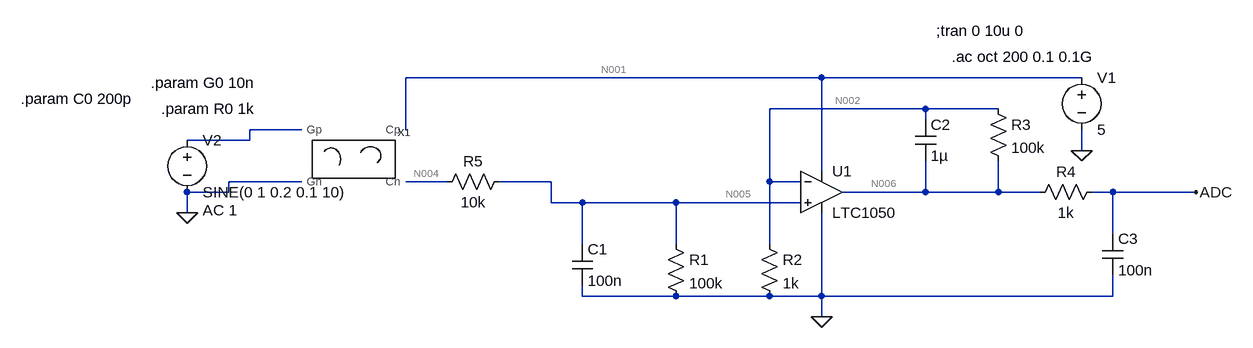
[diagram p0: schematic capteur.asc]
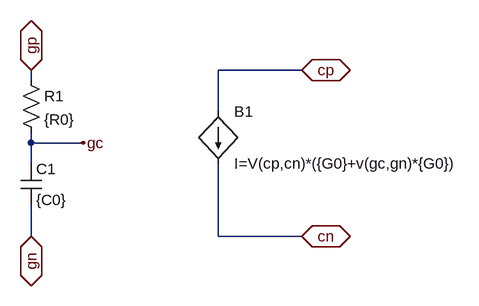
[diagram p1: sub-circuit gp_capteur_graphite.asc]
capteur.asc, the LTspice schematic file:
Version 4
SHEET 1 976 680
WIRE 336 -80 -304 -80
WIRE 736 -80 336 -80
WIRE 496 -32 256 -32
WIRE 608 -32 496 -32
WIRE 496 -16 496 -32
WIRE -464 0 -544 0
WIRE -304 0 -304 -80
WIRE -544 16 -544 0
WIRE -544 16 -640 16
WIRE 736 32 736 0
WIRE 336 64 336 -80
WIRE -464 80 -576 80
WIRE -240 80 -304 80
WIRE -80 80 -160 80
WIRE 256 80 256 -32
WIRE 304 80 256 80
WIRE -576 96 -576 80
WIRE -576 96 -640 96
WIRE 496 96 496 48
WIRE 496 96 368 96
WIRE 608 96 608 48
WIRE 608 96 496 96
WIRE 672 96 608 96
WIRE 784 96 752 96
WIRE 912 96 784 96
WIRE -80 112 -80 80
WIRE -32 112 -80 112
WIRE 112 112 -32 112
WIRE 304 112 112 112
WIRE -640 128 -640 96
WIRE 784 160 784 96
WIRE -32 176 -32 112
WIRE 112 176 112 112
WIRE 256 176 256 80
WIRE -32 256 -32 240
WIRE 112 256 -32 256
WIRE 256 256 112 256
WIRE 336 256 336 128
WIRE 336 256 256 256
WIRE 784 256 784 224
WIRE 784 256 336 256
WIRE 336 288 336 256
FLAG 336 288 0
FLAG 912 96 ADC
FLAG 736 32 0
FLAG -640 128 0
SYMBOL cap -48 176 R0
SYMATTR InstName C1
SYMATTR Value 100n
SYMBOL res 240 160 R0
SYMATTR InstName R2
SYMATTR Value 1k
SYMBOL OpAmps\\LTC1050 336 32 R0
SYMATTR InstName U1
SYMBOL res 96 160 R0
SYMATTR InstName R1
SYMATTR Value 100k
SYMBOL cap 480 -16 R0
SYMATTR InstName C2
SYMATTR Value 1µ
SYMBOL res 592 -48 R0
SYMATTR InstName R3
SYMATTR Value 100k
SYMBOL res 768 80 R90
WINDOW 0 0 56 VBottom 2
WINDOW 3 32 56 VTop 2
SYMATTR InstName R4
SYMATTR Value 1k
SYMBOL cap 768 160 R0
SYMATTR InstName C3
SYMATTR Value 100n
SYMBOL voltage 736 -96 R0
WINDOW 123 24 44 Left 2
WINDOW 39 0 0 Left 0
SYMATTR InstName V1
SYMATTR Value 5
SYMBOL res -144 64 R90
WINDOW 0 0 56 VBottom 2
WINDOW 3 32 56 VTop 2
SYMATTR InstName R5
SYMATTR Value 10k
SYMBOL GP_Capteur_Graphite -400 16 R0
SYMATTR InstName X1
SYMBOL voltage -640 0 R0
WINDOW 123 24 124 Left 2
WINDOW 39 0 0 Left 0
SYMATTR InstName V2
SYMATTR Value SINE(0 1 0.2 0.1 10)
SYMATTR Value2 AC 1
TEXT 512 -152 Left 2 !;tran 0 10u 0
TEXT 536 -112 Left 2 !.ac oct 200 0.1 0.1G
TEXT -696 -72 Left 2 !.param G0 10n
TEXT -680 -32 Left 2 !.param R0 1k
TEXT -896 -48 Left 2 !.param C0 200p

gp_capteur_graphite.asc, the sub-circuit schematic file:
Version 4
SHEET 1 880 680
WIRE 480 16 352 16
WIRE 64 32 64 16
WIRE 352 80 352 16
WIRE 64 128 64 112
WIRE 144 128 64 128
WIRE 64 160 64 128
WIRE 64 272 64 224
WIRE 352 272 352 160
WIRE 480 272 352 272
FLAG 64 16 gp
IOPIN 64 16 BiDir
FLAG 64 272 gn
IOPIN 64 272 BiDir
FLAG 144 128 gc
FLAG 480 16 cp
IOPIN 480 16 BiDir
FLAG 480 272 cn
IOPIN 480 272 BiDir
SYMBOL res 48 16 R0
SYMATTR InstName R1
SYMATTR Value {R0}
SYMBOL cap 48 160 R0
SYMATTR InstName C1
SYMATTR Value {C0}
SYMBOL bi 352 80 R0
SYMATTR InstName B1
SYMATTR Value I=V(cp,cn)*({G0}+v(gc,gn)*{G0})

The netlist it stands for:
* capteur.asc
C1 N005 0 100n
R2 N002 0 1k
XU1 N005 N002 N001 0 N006 LTC1050  ; pins In+ In- V+ V- OUT
R1 N005 0 100k
C2 N002 N006 1µ
R3 N002 N006 100k
R4 ADC N006 1k
C3 ADC 0 100n
V1 N001 0 5
R5 N005 N004 10k
XX1 N001 N004 N003 0 gp_capteur_graphite
V2 N003 0 SINE(0 1 0.2 0.1 10) AC 1

* block symbol definitions
.subckt gp_capteur_graphite Cp Cn Gp Gn
R1 gp gc {R0}
C1 gc gn {C0}
B1 cp cn I=V(cp,cn)*({G0}+v(gc,gn)*{G0})
.ends gp_capteur_graphite

;tran 0 10u 0
.ac oct 200 0.1 0.1G
.param G0 10n
.param R0 1k
.param C0 200p
.lib LTC.lib
.backanno
.end

* Results of the author's LTspice run, read from the files saved beside the schematic
* Operating Point, zero values left out:
*   V(n005) = 4.995 mV
*   V(n002) = 4.995 mV
*   V(n001) = 5 V
*   V(n006) = 504.4 mV
*   V(adc) = 504.4 mV
*   V(n004) = 5.494 mV
*   I(R2) = 4.995 µA
*   I(R1) = 49.95 nA
*   I(R3) = -4.995 µA
*   I(R5) = -49.95 nA
*   I(V1) = -754.2 µA
*   Ix(u1:3) = 754.1 µA
*   Ix(u1:4) = -749.1 µA
*   Ix(u1:5) = -4.995 µA
*   Ix(x1:CP) = 49.95 nA
*   Ix(x1:CN) = -49.95 nA
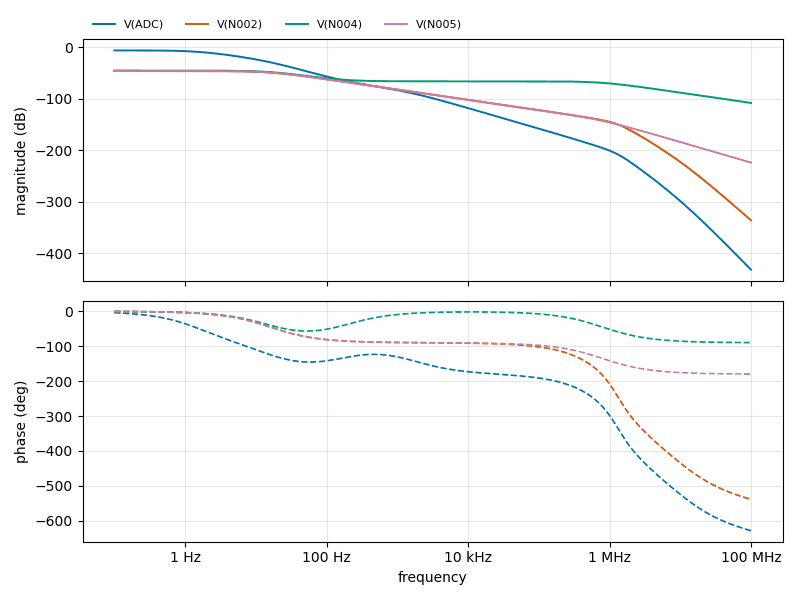
[diagram p2: AC Analysis of capteur.asc, plotted from the saved traces]
* AC Analysis, 1 run:
*   V(ADC): -5.97 dB at 100 mHz, -432.18 dB at 100 MHz, peak -5.97 dB at 100 mHz, 3 dB below the peak at 1.582 Hz
*   V(N002): -46.04 dB at 100 mHz, -336.21 dB at 100 MHz, peak -46.04 dB at 100 mHz, 3 dB below the peak at 15.93 Hz
*   V(N004): -45.21 dB at 100 mHz, -108.02 dB at 100 MHz, peak -45.21 dB at 100 mHz, 3 dB below the peak at 16.07 Hz
*   V(N005): -46.04 dB at 100 mHz, -223.98 dB at 100 MHz, peak -46.04 dB at 100 mHz, 3 dB below the peak at 15.93 Hz